# EAGLE design CarrierBoard_V7 (EAGLE 7.7.0)

## Sheet 1 of 2
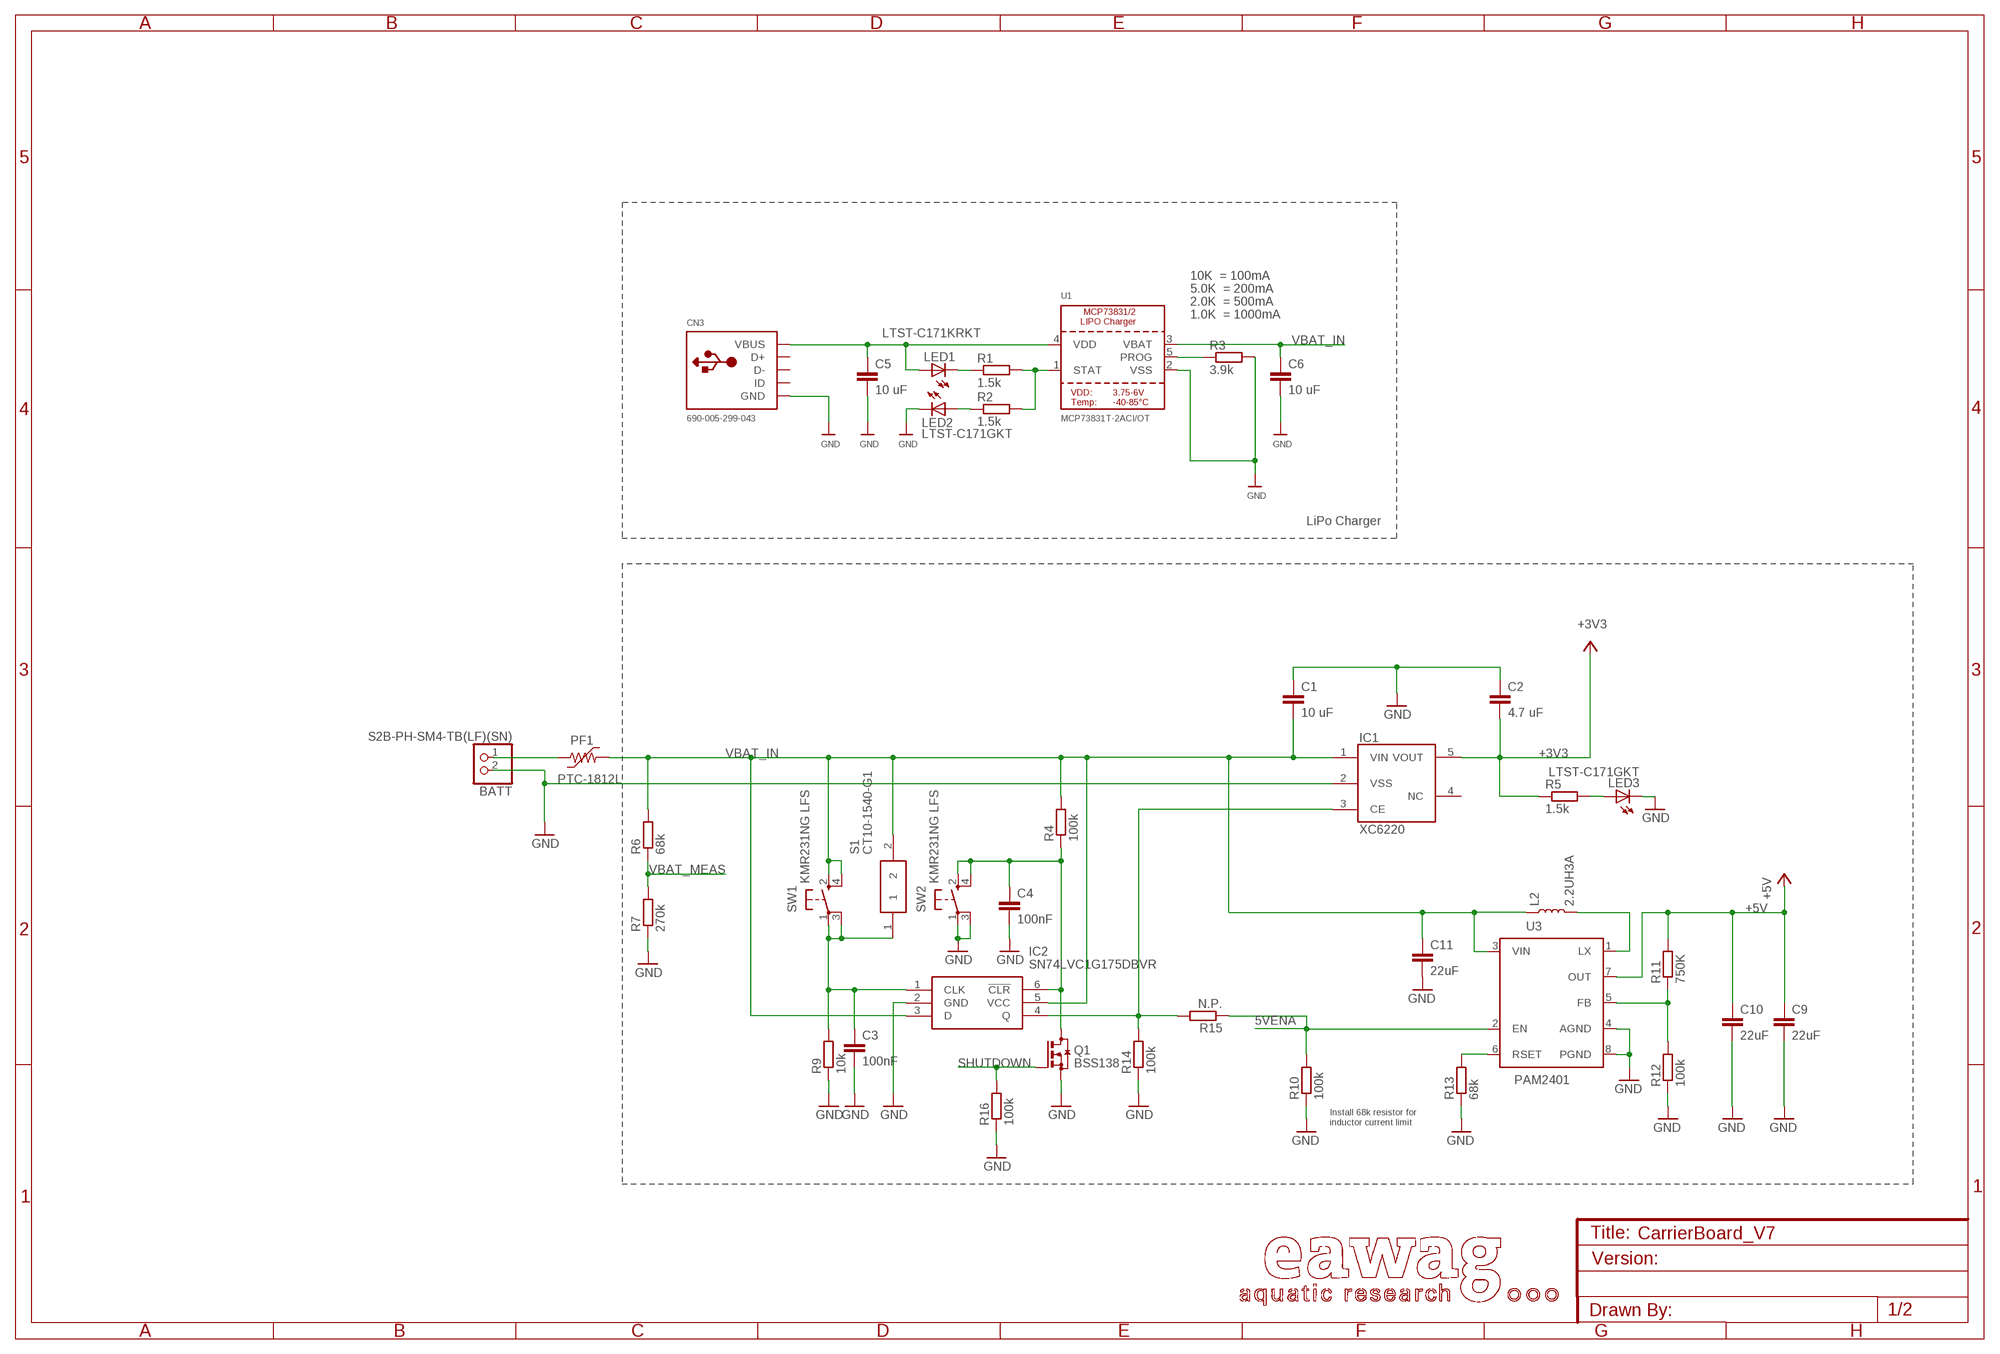
[diagram p0: schematic, sheet 1]

### Parts
BATT  S2B-PH-SM4-TB(LF)(SN)  JST_2PIN-SMT-RA  [JST-PH-2-SMT-RA]
C1  10 uF  C-EUC1206  [C1206]
C2  4.7 uF  C-EUC1206  [C1206]
C3  100nF  C-EUC0603  [C0603]
C4  100nF  C-EUC0603  [C0603]
C5  10 uF  C-EUC1206  [C1206]
C6  10 uF  C-EUC1206  [C1206]
C9  22uF  C-EUC0805  [C0805]
C10  22uF  C-EUC0805  [C0805]
C11  22uF  C-EUC0805  [C0805]
CN3  690-005-299-043  USBMINIB  [USB-MINIB]
IC1  XC6220SOT-25  [SOT25]
IC2  SN74LVC1G175DBVR  [SOT95P280X145-6N]
L2  2.2UH3A  INDUCTOR-IFSC1515AHER2R2M01  [INDUCTOR_4X4MM]
LED1  LTST-C171KRKT  LEDCHIPLED_0805  [CHIPLED_0805]
LED2  LTST-C171GKT  LEDCHIPLED_0805  [CHIPLED_0805]
LED3  LTST-C171GKT  LEDCHIPLED_0805  [CHIPLED_0805]
PF1  PTC-1812L  [1812L]
Q1  BSS138  [SOT23]
R1  1.5k  R-EU_R0603  [R0603]
R2  1.5k  R-EU_R0603  [R0603]
R3  3.9k  R-EU_R0603  [R0603]
R4  100k  R-EU_R0603  [R0603]
R5  1.5k  R-EU_R0603  [R0603]
R6  68k  R-EU_R0603  [R0603]
R7  270k  R-EU_R0603  [R0603]
R9  10k  R-EU_R0603  [R0603]
R10  100k  R-EU_R0603  [R0603]
R11  750K  R-EU_R0603  [R0603]
R12  100k  R-EU_R0603  [R0603]
R13  68k  R-EU_R0603  [R0603]
R14  100k  R-EU_R0603  [R0603]
R15  N.P.  R-EU_R0603  [R0603]
R16  100k  R-EU_R0603  [R0603]
S1  CT10-1540-G1  [CT101540G1]
SW1  KMR231NG LFS  SPST_TACT-KMR2  [KMR2]
SW2  KMR231NG LFS  SPST_TACT-KMR2  [KMR2]
U1  MCP73831T-2ACI/OT  MCP73831/2  [SOT23-5]
U3  PAM2401  [MSOP8]

### Nets
5VENA: R10.2 R15.1 U3.2(EN) ; also sheet 2
+3V3: C2.2 IC1.5(VOUT) R5.1 ; also sheet 2
+5V: C9.1 C10.1 R11.2 U3.7(OUT) ; also sheet 2
CLR: C4.1 IC2.6(!CLR) Q1.3(D) R4.1 SW2.2(S) SW2.4(S1)
GND: BATT.2 C1.1 C2.1 C3.2 C4.2 C5.2 C6.2 C9.2 C10.2 C11.2 CN3.GND IC1.2(VSS) IC2.2(GND) LED2.C LED3.C Q1.2(S) R3.2 R7.1 R9.1 R10.1 R12.1 R13.1 R14.1 R16.1 SW2.1(P) SW2.3(P1) U1.2(VSS) U3.4(AGND) U3.8(PGND) ; also sheet 2
N$1: LED1.C R1.1
N$2: R11.1 R12.2 U3.5(FB)
N$3: R1.2 R2.2 U1.1(STAT)
N$4: R3.1 U1.5(PROG)
N$9: LED3.A R5.2
N$10: BATT.1 PF1.1
N$18: L2.P$2 U3.1(LX)
N$19: R13.2 U3.6(RSET)
N$20: LED2.A R2.1
ON: C3.1 IC2.1(CLK) R9.2 S1.1 SW1.1(P) SW1.3(P1)
PWR_ENABLE: IC1.3(CE) IC2.4(Q) R14.2 R15.2
SHUTDOWN: Q1.1(G) R16.2 ; also sheet 2
VBAT_IN: C1.2 C6.1 C11.1 IC1.1(VIN) IC2.3(D) IC2.5(VCC) L2.P$1 PF1.2 R4.2 R6.2 S1.2 SW1.2(S) SW1.4(S1) U1.3(VBAT) U3.3(VIN)
VBAT_MEAS: R6.1 R7.2 ; also sheet 2
VDD1: C5.1 CN3.VBUS LED1.A U1.4(VDD)
Unconnected: CN3.D+ CN3.D- CN3.ID IC1.4(NC)

### Notes on the sheet
- 10K  = 100mA
- 5.0K  = 200mA
- 2.0K  = 500mA
- 1.0K  = 1000mA
- LiPo Charger
- Install 68k resistor for
  inductor current limit

## Sheet 2 of 2
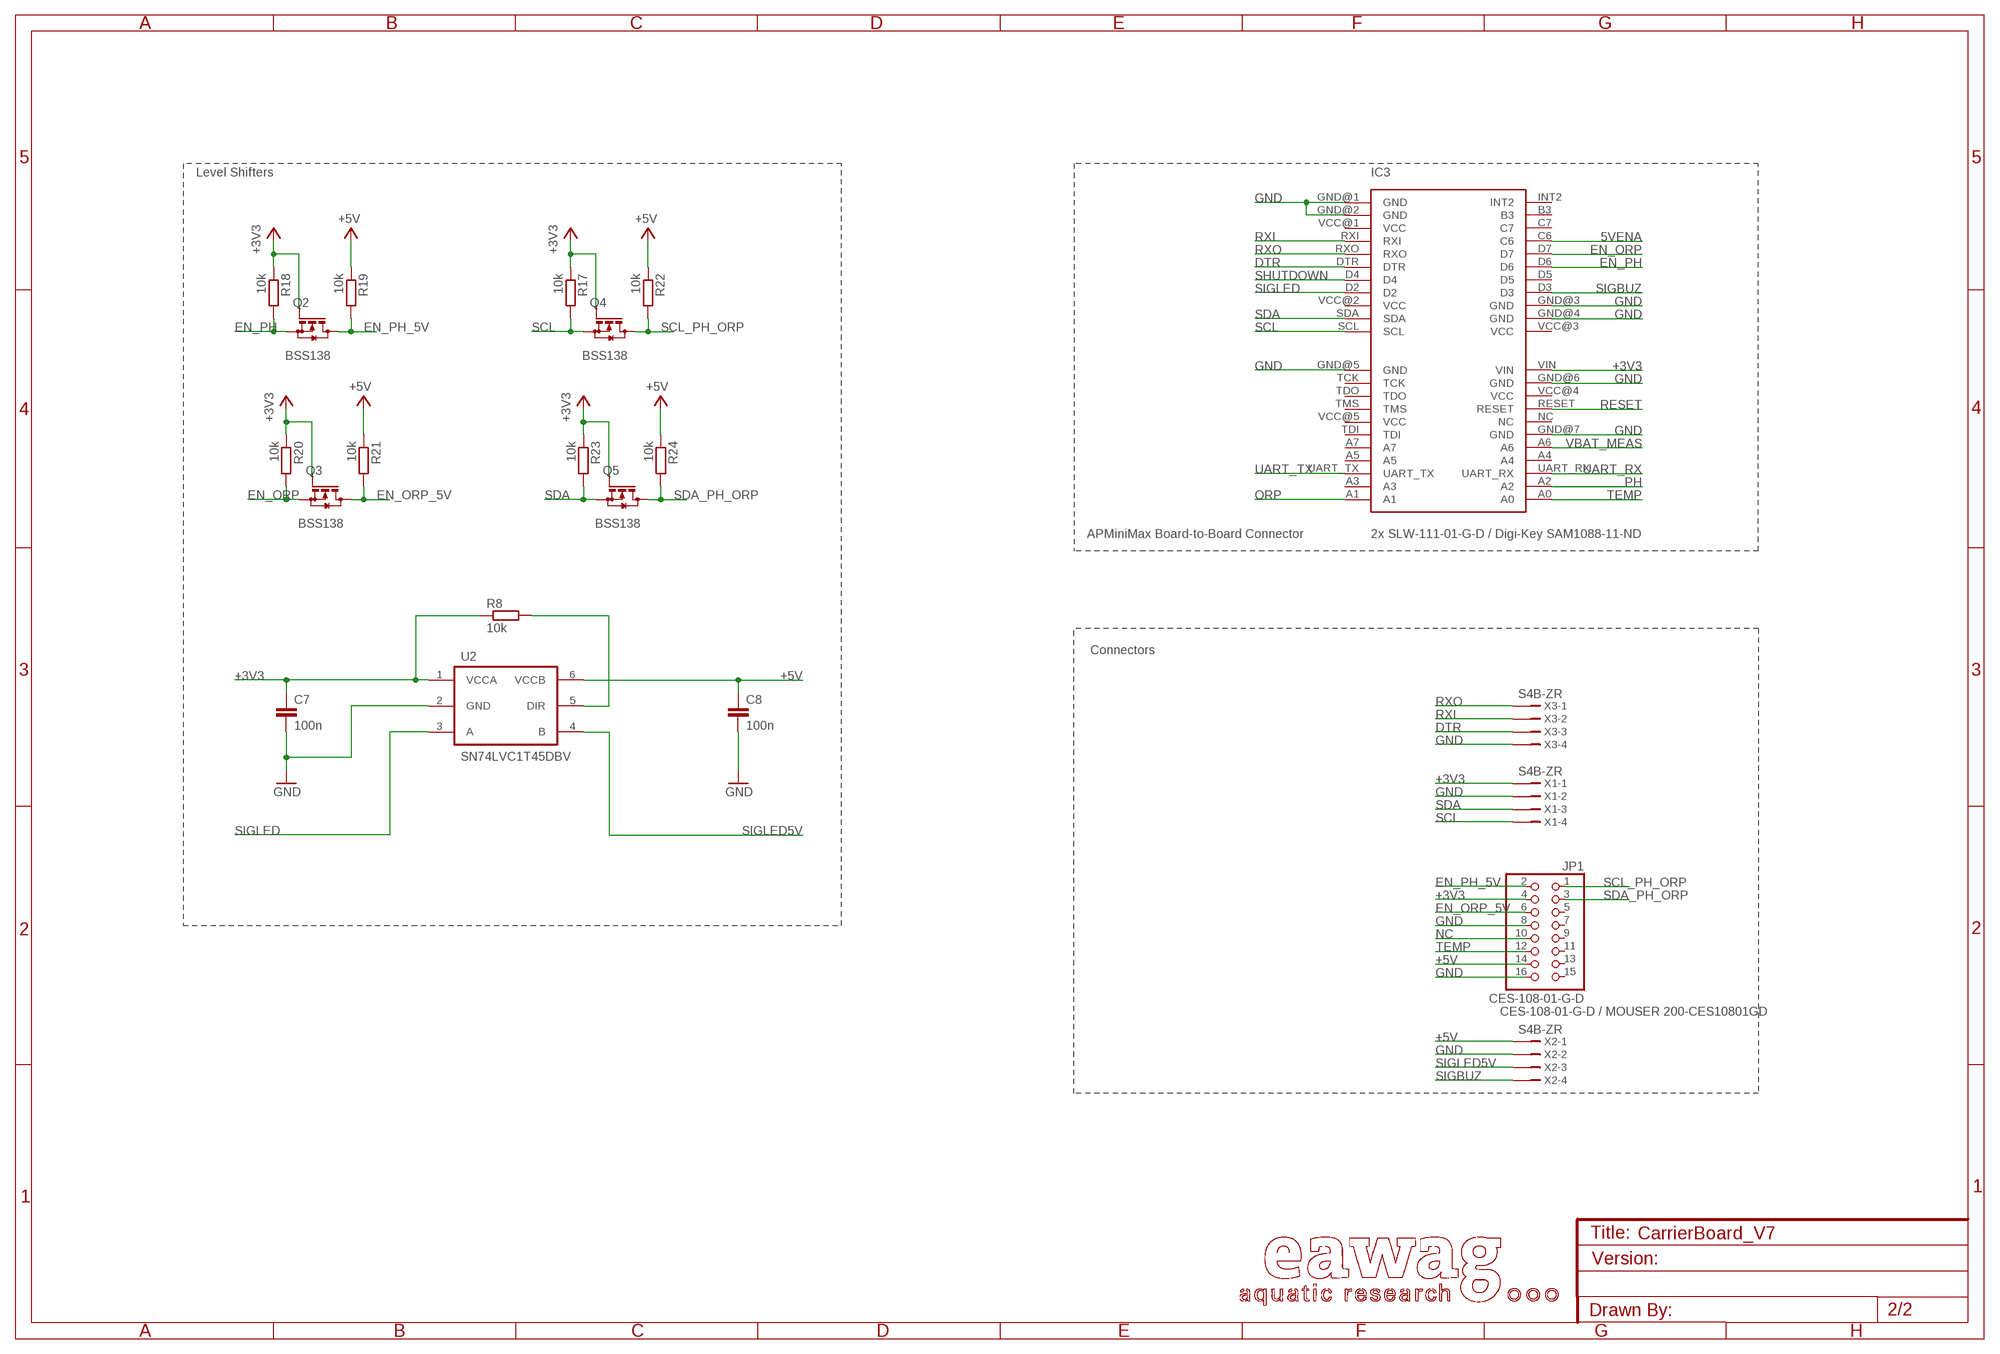
[diagram p1: schematic, sheet 2]

### Parts
C7  100n  C-EUC0805  [C0805]
C8  100n  C-EUC0805  [C0805]
IC3  SLW-111-01-G-D  APE  [APE]
JP1  CES-108-01-G-D  PINHD-2X8  [2X08]
Q2  BSS138  [SOT23]
Q3  BSS138  [SOT23]
Q4  BSS138  [SOT23]
Q5  BSS138  [SOT23]
R8  10k  R-EU_R0603  [R0603]
R17  10k  R-EU_R0603  [R0603]
R18  10k  R-EU_R0603  [R0603]
R19  10k  R-EU_R0603  [R0603]
R20  10k  R-EU_R0603  [R0603]
R21  10k  R-EU_R0603  [R0603]
R22  10k  R-EU_R0603  [R0603]
R23  10k  R-EU_R0603  [R0603]
R24  10k  R-EU_R0603  [R0603]
U2  SN74LVC1T45DBV  [SOT23-6]
X1  S4B-ZR  [S4B-ZR]
X2  S4B-ZR  [S4B-ZR]
X3  S4B-ZR  [S4B-ZR]

### Nets
5VENA: IC3.C6 ; also sheet 1
+3V3: C7.1 IC3.VIN JP1.4 Q2.1(G) Q3.1(G) Q4.1(G) Q5.1(G) R8.1 R17.1 R18.1 R20.1 R23.1 U2.1(VCCA) X1.1 ; also sheet 1
+5V: C8.1 JP1.14 R19.1 R21.1 R22.1 R24.1 U2.6(VCCB) X2.1 ; also sheet 1
DTR: IC3.DTR X3.3
EN_ORP: IC3.D7 Q3.2(S) R20.2
EN_ORP_5V: JP1.6 Q3.3(D) R21.2
EN_PH: IC3.D6 Q2.2(S) R18.2
EN_PH_5V: JP1.2 Q2.3(D) R19.2
GND: C7.2 C8.2 IC3.GND@1(GND) IC3.GND@2(GND) IC3.GND@3(GND) IC3.GND@4(GND) IC3.GND@5(GND) IC3.GND@6(GND) IC3.GND@7(GND) JP1.8 JP1.16 U2.2(GND) X1.2 X2.2 X3.4 ; also sheet 1
N$15: R8.2 U2.5(DIR)
NC: JP1.10
ORP: IC3.A1
PH: IC3.A2
RESET: IC3.RESET
RXI: IC3.RXI X3.2
RXO: IC3.RXO X3.1
SCL: IC3.SCL Q4.2(S) R17.2 X1.4
SCL_PH_ORP: JP1.1 Q4.3(D) R22.2
SDA: IC3.SDA Q5.2(S) R23.2 X1.3
SDA_PH_ORP: JP1.3 Q5.3(D) R24.2
SHUTDOWN: IC3.D4 ; also sheet 1
SIGBUZ: IC3.D3 X2.4
SIGLED: IC3.D2 U2.3(A)
SIGLED5V: U2.4(B) X2.3
TEMP: IC3.A0 JP1.12
UART_RX: IC3.UART_RX
UART_TX: IC3.UART_TX
VBAT_MEAS: IC3.A6 ; also sheet 1
Unconnected: IC3.A3 IC3.A4 IC3.A5 IC3.A7 IC3.B3 IC3.C7 IC3.D5 IC3.INT2 IC3.NC IC3.TCK IC3.TDI IC3.TDO IC3.TMS IC3.VCC@1(VCC) IC3.VCC@2(VCC) IC3.VCC@3(VCC) IC3.VCC@4(VCC) IC3.VCC@5(VCC) JP1.5 JP1.7 JP1.9 JP1.11 JP1.13 JP1.15

### Notes on the sheet
- Level Shifters
- APMiniMax Board-to-Board Connector | 2x SLW-111-01-G-D / Digi-Key SAM1088-11-ND
- Connectors
- CES-108-01-G-D / MOUSER 200-CES10801GD

## Library data of the parts
BATT = adafruit:JST_2PIN: JST 2-Pin Connectors of various flavors SMT-RA (S2B-PH-SM4) 4UConnector #17311 SMT (B2B-PH-SM4) THM-RA (S2B-PH) THM (B2B-PH)
C1 C2 C5-C8 = rcl:C-EU: CAPACITOR, European symbol
C3 C4 C9-C11 = 1_RCL-eawag:C-EU: CAPACITOR, European symbol
CN3 = adafruit:USB: USB Connectors USBMINIB - Surface Mount Female Mini-B USB Connector 4UConnector: 06564 By microbuilder.eu Thru-hole RA Female Mini-B USB Connector 4UConnector: 18732 By ladyada.net
IC1 = eawag:XC6220: XC6220 Series 1A LDO Voltage Regulator with "Green Operation" Digikey Part Nr: 893-1133-1-ND
IC2 = SamacSys_Parts:SN74LVC1G175DBVR: Single D-Type Flip-Flop with Asynchronous Clear Source: Datasheet <http://www.ti.com/lit/ds/symlink/sn74lvc1g175.pdf>; DESCRIPTION: Single D-Type Flip-Flop with Asynchronous Clear; HEIGHT: 1.45mm; MANUFACTURER_NAME: Texas Instruments; MANUFACTURER_PART_NUMBER: SN74LVC1G175DBVR; MOUSER_PART_NUMBER: 595-SN74LVC1G175DBVR; MOUSER_PRICE-STOCK: https://www.mouser.com/Search/Refine.aspx?Keyword=595-SN74LVC1G175DBVR
IC3 = eawag:APE
JP1 = pinhead:PINHD-2X8: PIN HEADER
L2 = SparkFun-Coils:INDUCTOR: Inductors Resist changes in electrical current. Basically a coil of wire. SparkFun Products: SparkFun Load Cell Amplifier - HX711 <https://www.sparkfun.com/products/13879> IOIO-OTG - V2.2 <https://www.sparkfun.com/products/13613>; PROD_ID: NDUC-13770
LED1 LED2 = adafruit:LED: LED OSRAM: - CHIPLED LG R971, LG N971, LY N971, LG Q971, LY Q971, LO R971, LY R971 LH N974, LH R974 LS Q976, LO Q976, LY Q976 LO Q996 - Hyper CHIPLED LW Q18S LB Q993, LB Q99A, LB R99A - SideLED LS A670, LO A670, LY A670, LG A670, LP A670 LB A673, LV A673, LT A673, LW A673 LH A674 LY A675 LS A676, LA A676, LO A676, LY A676, LW A676 LS A679, LY A679, LG A679 - Hyper Micro SIDELED® LS Y876, LA Y876, LO Y876, LY Y876 LT Y87S - SmartLED LW L88C, LW L88S LB L89C, LB L89S, LG L890 LS L89K, LO L89K, LY L89K LS L896, LA L896, LO L896, LY L896 - TOPLED LS T670, LO T670, LY T670, LG T670, LP T670 LSG T670, LSP T670, LSY T670, LOP T670, LYG T670 LG T671, LOG T671, LSG T671 LB T673, LV T673, LT T673, LW T673 LH T674 LS T676, LA T676, LO T676, LY T676, LB T676, LH T676, LSB T676, LW T676 LB T67C, LV T67C, LT T67C, LS T67K, LO T67K, LY T67K, LW E67C LS E67B, LA E67B, LO E67B, LY E67B, LB E67C, LV E67C, LT E67C LW T67C LS T679, LY T679, LG T679 LS T770, LO T770, LY T770, LG T770, LP T770 LB T773, LV T773, LT T773, LW T773 LH T774 LS E675, LA E675, LY E675, LS T675 LS T776, LA T776, LO T776, LY T776, LB T776 LHGB T686 LT T68C, LB T68C - Hyper Mini TOPLED® LB M676 - Mini TOPLED Santana® LG M470 LS M47K, LO M47K, LY M47K Source: http://www.osram.convergy.de/
LED3 = eawag:LED: LED OSRAM: - CHIPLED LG R971, LG N971, LY N971, LG Q971, LY Q971, LO R971, LY R971 LH N974, LH R974 LS Q976, LO Q976, LY Q976 LO Q996 - Hyper CHIPLED LW Q18S LB Q993, LB Q99A, LB R99A - SideLED LS A670, LO A670, LY A670, LG A670, LP A670 LB A673, LV A673, LT A673, LW A673 LH A674 LY A675 LS A676, LA A676, LO A676, LY A676, LW A676 LS A679, LY A679, LG A679 - Hyper Micro SIDELED® LS Y876, LA Y876, LO Y876, LY Y876 LT Y87S - SmartLED LW L88C, LW L88S LB L89C, LB L89S, LG L890 LS L89K, LO L89K, LY L89K LS L896, LA L896, LO L896, LY L896 - TOPLED LS T670, LO T670, LY T670, LG T670, LP T670 LSG T670, LSP T670, LSY T670, LOP T670, LYG T670 LG T671, LOG T671, LSG T671 LB T673, LV T673, LT T673, LW T673 LH T674 LS T676, LA T676, LO T676, LY T676, LB T676, LH T676, LSB T676, LW T676 LB T67C, LV T67C, LT T67C, LS T67K, LO T67K, LY T67K, LW E67C LS E67B, LA E67B, LO E67B, LY E67B, LB E67C, LV E67C, LT E67C LW T67C LS T679, LY T679, LG T679 LS T770, LO T770, LY T770, LG T770, LP T770 LB T773, LV T773, LT T773, LW T773 LH T774 LS E675, LA E675, LY E675, LS T675 LS T776, LA T776, LO T776, LY T776, LB T776 LHGB T686 LT T68C, LB T68C - Hyper Mini TOPLED® LB M676 - Mini TOPLED Santana® LG M470 LS M47K, LO M47K, LY M47K Source: http://www.osram.convergy.de/
PF1 = polyswitch:PTC-: POLYSWITCH Polyswitch Resetable Fuses
Q1-Q5 = transistor-small-signal:BSS138: N-CHANNEL MOS FET
R1-R4 R6 R9-R24 = 1_RCL-eawag:R-EU_: RESISTOR, European symbol
R5 R7 R8 = rcl:R-EU_: RESISTOR, European symbol
S1 = SamacSys_Parts:CT10-1540-G1: Magnetic / Reed Switches MOLDED 15-40AT SPST Source: Datasheet <https://componentsearchengine.com/Datasheets/1/CT10-1540-G1.pdf>; DESCRIPTION: Magnetic / Reed Switches MOLDED 15-40AT SPST; HEIGHT: 2.92mm; MANUFACTURER_NAME: Coto Technology; MANUFACTURER_PART_NUMBER: CT10-1540-G1; MOUSER_PART_NUMBER: 816-CT10-1540-G1; MOUSER_PRICE-STOCK: https://www.mouser.com/Search/Refine.aspx?Keyword=816-CT10-1540-G1
SW1 SW2 = adafruit:SPST_TACT: SMT 6mm switch, EVQQ2 series http://www.ladyada.net/library/eagle
U1 = microbuilder:MCP73831/2: MCP73831/2 LIPO Charger VDD: 3.75 - 6V Temp -40 - 85°C Programmable Charge Rate: 15-500mA NOTE: STAT is a tri-state logic output on the MCP73831 and an open-drain output on the MCP73832. SOT23-5 with 4.2V output and tri-state logic on STAT = MCP73831T-2ACI/OT
U2 = 74LV:SN74LVC1T45: SINGLE-BIT DUAL-SUPPLY BUS TRANSCEIVER
U3 = SparkFun-IC-Power:PAM2401: PAM2401 - Boost PMIC Specifications: Up to 1A output current 0.9V to 4.75V Input Range 2.5V to 5.0V Adjustable Output Voltage Datasheet <https://www.diodes.com/assets/Datasheets/PAM2401.pdf> (Diodes inc.); PROD_ID: IC-13769
X1-X3 = con-jst:?4B-ZR: ZH CONNECTOR 1.5 mm, 4 pin 1 row Source: http://www.jst.com .. eZH.pdf; MF: FARNELL; MPN: S4B-ZR(LF)(SN); OC_FARNELL: 9491830; OC_NEWARK: 38K8076

## Board
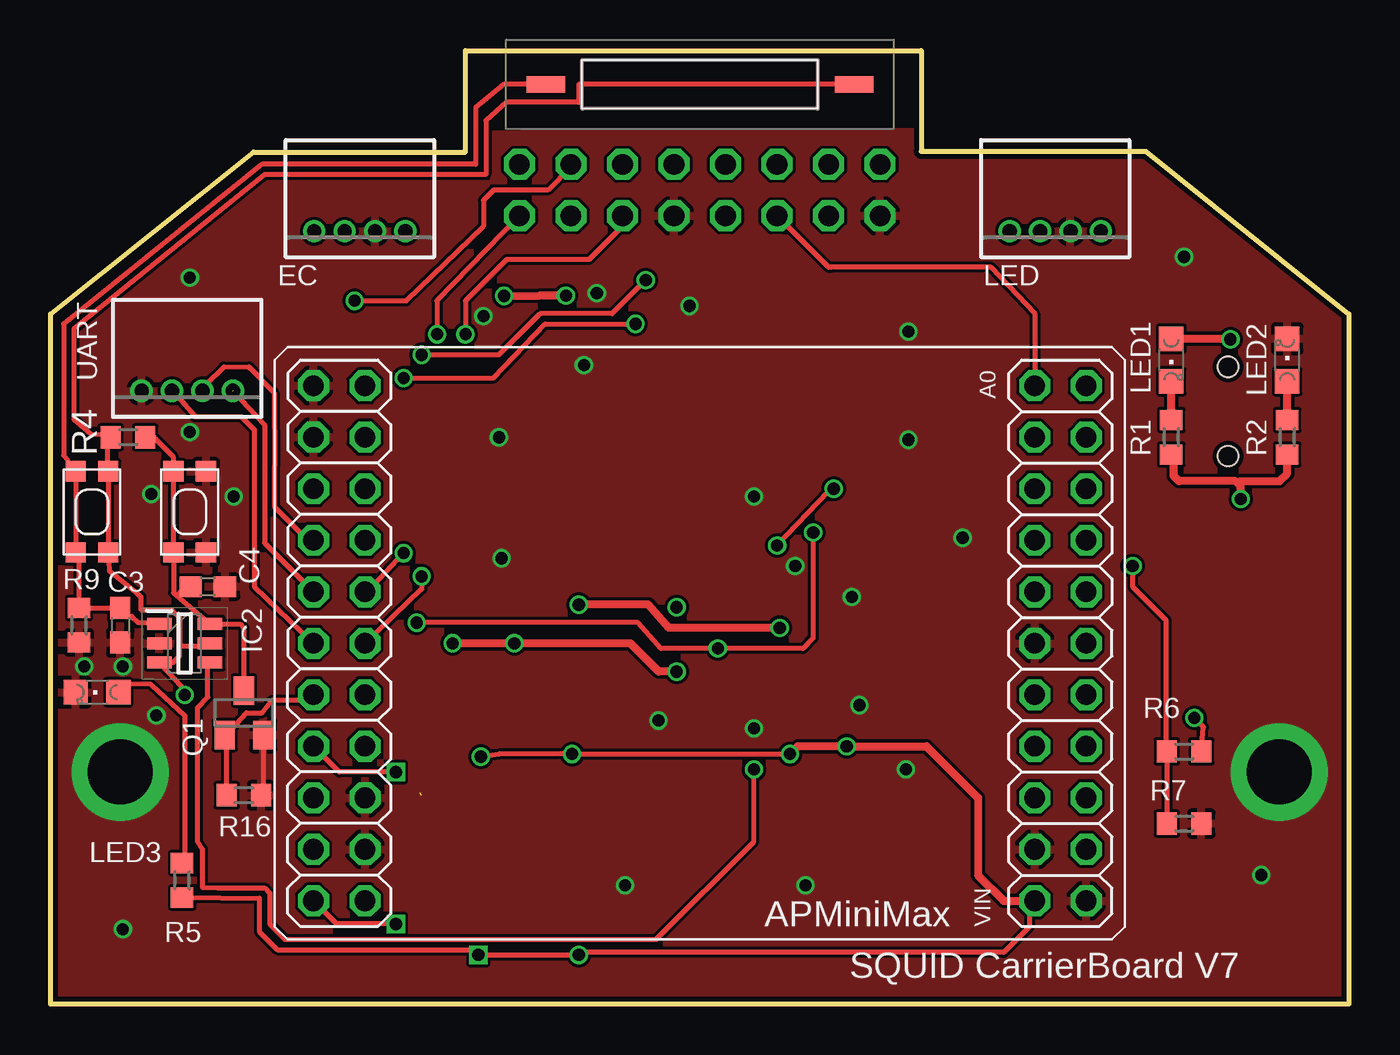
[diagram p2: board, top side]
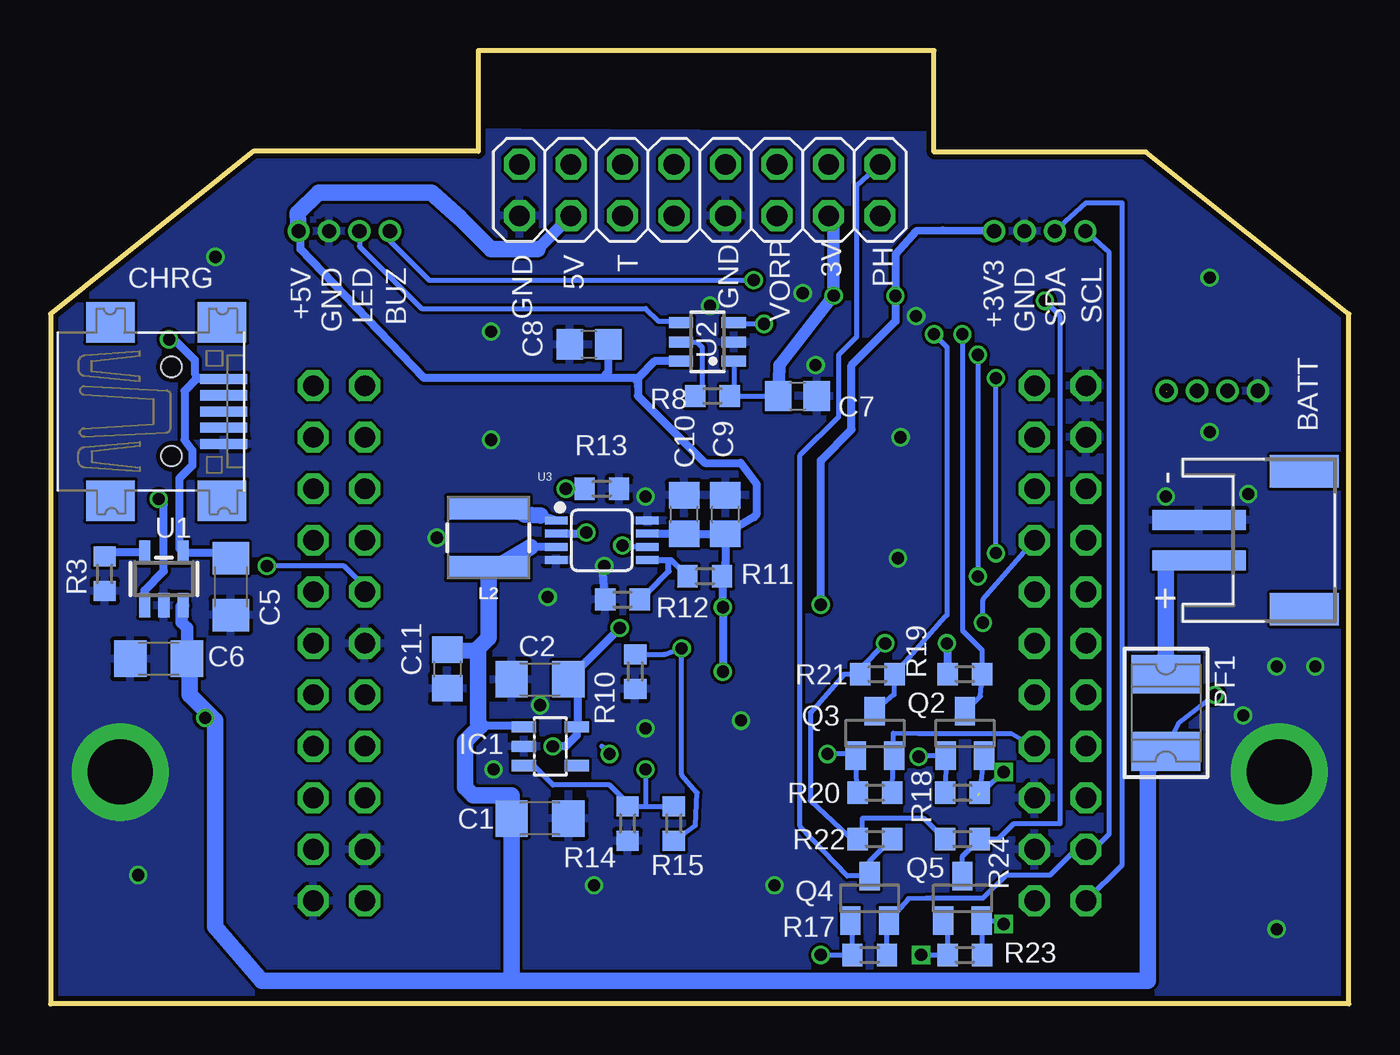
[diagram p3: board, bottom side, seen from below]

Size 64 x 47 mm. Coordinates in mm from the lower left corner, seen from the top.
Outline: 64,34.02 64,0 0,0 0,34.02 10,42 20.45,42 20.45,47 42.93,47 42.93,42.04 54,42.04 64,34.02
Copper layers (1*16): Top 0.018mm / dielectric 1.55mm / Bottom 0.018mm
Design rules "eC_2Layer_PClass6_BaseCopperO18_eCDefault": minimum track width 0.15mm, minimum drill 0.35mm, track to track 0.15mm, track to pad 0.15mm, pad to pad 0.15mm, via to via 0.15mm, smd to smd 0mil, copper to edge 0.25mm, drill to drill 0.35mm, minimum pad ring 0.175mm, minimum via ring 0.125mm, stop-mask expansion 0mil, vias tented up to drill 0.45mm, thermal gap 0.2mm

### Footprints (pad centres in the part's own frame; a part is rotated, then mirrored left to right if it is on the bottom)
JST-PH-2-SMT-RA = smd 1 x 4.6: 1 1,-3.7; 2 -1,-3.7 | smd 1.6 x 3.4: NC1 -3.4,1.5; NC2 3.4,1.5
C1206 = smd 1.6 x 1.8: 1 -1.4,0; 2 1.4,0
C0603 = smd 1.1 x 1: 1 -0.85,0; 2 0.85,0
C0805 = smd 1.3 x 1.5: 1 -0.95,0; 2 0.95,0
USB-MINIB = smd 0.5 x 2.308: D+ 0,3.588; D- -0.8,3.588; GND 1.6,3.588; ID 0.8,3.588; VBUS -1.6,3.588 | smd 2 x 2.4: GND1 -4.4,-2; GND2 -4.4,3.5; GND3 4.4,3.5; GND4 4.4,-2 | hole 1: -2.2,1; 2.2,1
SOT25 = smd 0.55 x 1.2: 1 -0.95,-1.3; 2 0,-1.3; 3 0.95,-1.3; 4 0.95,1.3; 5 -0.95,1.3
SOT95P280X145-6N = smd 1.2 x 0.6: 1 -1.25,0.95; 2 -1.25,0; 3 -1.25,-0.95; 4 1.25,-0.95; 5 1.25,0; 6 1.25,0.95
APE = drill 1.016 octagon: A0 16.51,12.7; A1 19.05,12.7; A2 16.51,10.16; A3 19.05,10.16; A4 16.51,5.08; A5 19.05,5.08; A6 16.51,2.54; A7 19.05,2.54; B3 -16.51,10.16; C6 -16.51,5.08; C7 -16.51,7.62; D2 -16.51,2.54; D3 -16.51,0; D4 -19.05,-2.54; D5 -16.51,-2.54; D6 -19.05,-5.08; D7 -16.51,-5.08; DTR -19.05,0; GND@1 -19.05,12.7; GND@2 -19.05,10.16; GND@3 -16.51,-7.62; GND@4 -16.51,-10.16; GND@5 19.05,-12.7; GND@6 16.51,-10.16; GND@7 16.51,0; INT2 -16.51,12.7; NC 16.51,-2.54; RESET 16.51,-5.08; RXI -19.05,5.08; RXO -19.05,2.54; SCL -19.05,-10.16; SDA -19.05,-12.7; TCK 19.05,-10.16; TDI 19.05,0; TDO 19.05,-7.62; TMS 19.05,-5.08; UART_RX 16.51,7.62; UART_TX 19.05,7.62; VCC@1 -19.05,7.62; VCC@2 -19.05,-7.62; VCC@3 -16.51,-12.7; VCC@4 16.51,-7.62; VCC@5 19.05,-2.54; VIN 16.51,-12.7
2X08 = drill 1.016 octagon: 1 -8.89,-1.27; 2 -8.89,1.27; 3 -6.35,-1.27; 4 -6.35,1.27; 5 -3.81,-1.27; 6 -3.81,1.27; 7 -1.27,-1.27; 8 -1.27,1.27; 9 1.27,-1.27; 10 1.27,1.27; 11 3.81,-1.27; 12 3.81,1.27; 13 6.35,-1.27; 14 6.35,1.27; 15 8.89,-1.27; 16 8.89,1.27
INDUCTOR_4X4MM = smd 4.089 x 1.143: P$1 0,1.473; P$2 0,-1.473
CHIPLED_0805 = smd 1.2 x 1.2: A 0,-1.05; C 0,1.05
1812L = smd 1.905 x 3.404: 1 -1.905,0; 2 1.905,0
SOT23 = smd 1 x 1.4: 1 -0.95,-1.1; 2 0.95,-1.1; 3 0,1.1
R0603 = smd 1 x 1.1: 1 -0.85,0; 2 0.85,0
CT101540G1 = smd 1.9 x 0.8: 1 -7.6,0; 2 7.6,0
KMR2 = smd 1 x 1: 1 2,0.8; 2 2,-0.8; 3 -2,0.8; 4 -2,-0.8
SOT23-5 = smd 0.55 x 1.2: 1 -0.95,-1.3; 2 0,-1.3; 3 0.95,-1.3; 4 0.95,1.3; 5 -0.95,1.3
SOT23-6 = smd 0.55 x 1.2: 1 -0.95,-1.3; 2 0,-1.3; 3 0.95,-1.3; 4 0.95,1.3; 5 0,1.3; 6 -0.95,1.3
MSOP8 = smd 0.4 x 1.1: 1 -0.975,-2.25; 2 -0.325,-2.25; 3 0.325,-2.25; 4 0.975,-2.25; 5 0.975,2.25; 6 0.325,2.25; 7 -0.325,2.25; 8 -0.975,2.25
S4B-ZR = drill 0.7 pad 1.1: 1 -2.25,0; 2 -0.75,0; 3 0.75,0; 4 2.25,0

### Placement (x,y rotation side)
BATT  3.68,22.86 270 bottom
C1  39.88,9.14 180 bottom
C2  39.88,16 0 bottom
C3  3.43,18.67 270 top
C4  7.75,20.57 0 top
C5  55.12,20.57 270 bottom
C6  58.67,17.02 180 bottom
C7  27.18,29.97 0 bottom
C8  37.47,32.51 180 bottom
C9  30.73,24.13 90 bottom
C10  32.77,24.13 90 bottom
C11  44.45,16.51 270 bottom
CN3  59.05,29.21 270 bottom
IC1  39.37,12.7 270 bottom
IC2  6.6,17.78 0 top
IC3  32,17.78 0 top
JP1  32,40.13 180 bottom
L2  42.42,22.99 180 bottom
LED1  55.24,31.75 180 top
LED2  60.96,31.75 0 top
LED3  2.29,15.37 90 top
PF1  9.02,14.35 270 bottom
Q1  9.53,14.35 0 top
Q2  18.92,13.34 0 bottom
Q3  23.37,13.34 0 bottom
Q4  23.62,5.21 0 bottom
Q5  19.05,5.21 0 bottom
R1  55.24,27.94 270 top
R2  60.96,27.94 270 top
R3  61.34,21.21 270 bottom
R4  3.81,27.94 180 top
R5  6.48,6.1 90 top
R6  55.88,12.45 0 top
R7  55.88,8.89 180 top
R8  31.37,29.97 180 bottom
R9  1.4,18.67 90 top
R10  35.18,16.38 90 bottom
R11  31.75,21.08 0 bottom
R12  35.81,19.94 0 bottom
R13  36.83,25.4 180 bottom
R14  35.56,8.89 90 bottom
R15  33.27,8.89 90 bottom
R16  9.53,10.29 180 top
R17  23.62,2.41 0 bottom
R18  19.05,10.41 0 bottom
R19  18.92,16.26 0 bottom
R20  23.37,10.41 0 bottom
R21  23.24,16.26 0 bottom
R22  23.37,8.13 0 bottom
R23  18.92,2.41 0 bottom
R24  19.05,8.13 0 bottom
S1  32,45.34 0 top
SW1  2.03,24.26 90 top
SW2  6.86,24.26 270 top
U1  58.42,20.95 0 bottom
U2  31.62,32.64 90 bottom
U3  36.83,22.86 270 bottom
X1  15.24,38.1 180 top
X2  49.53,38.1 180 top
X3  6.73,30.23 180 top

### Tracks (layer width: path | path; a pad name or v marks a point on that pad's centre or on a via)
5VENA  (via drill 0.6)
  Top 0.254: v37.59,23.24 37.59,18.03 37.08,17.53 v32.89,17.53 30.1,17.53 28.96,18.8 v18.03,18.8
  Bottom 0.254: v18.03,18.8 18.03,19.94 IC3.C6 | R10.2 33.74,17.23 v32.89,17.53 32.89,11.3 32.13,10.41 32.22,8.8 R15.1
  Bottom 0.406: U3.2 37.59,23.18 v37.59,23.24
+3V3  (via drill 0.6)
  Top 0.254: v36.45,12.32 v25.71,12.32 22.1,12.32 v21.21,12.19 | R5.1 10.29,5.21 10.29,3.56 11.18,2.67 20.83,2.67 v21.08,2.41 v26.04,2.41 | 48.26,5.08 48.26,3.81 46.99,2.54 26.16,2.54
  Top 0.406: IC3.VIN 48.26,5.08 46.99,5.08 45.72,6.35 45.72,10.16 43.18,12.7 v39.24,12.7 36.83,12.7 v36.45,12.32 | 26.16,2.54 v26.04,2.41 | v35.94,18.54 30.48,18.54 29.46,19.68 v26.04,19.68 | v25.4,34.92 24.13,34.92 v22.35,34.91
  Bottom 0.254: U2.1 30.32,30.07 R8.1 C7.1 | v25.71,12.32 24.38,12.32 24.02,12.08 Q3.1 R20.1 | v36.45,12.32 36.83,12.7 | R18.1 Q2.1 21.17,12.23 v21.21,12.19 | 38.1,15.24 38,15.24 | Q4.1 24.47,4.01 R17.1 v26.04,2.41 | Q5.1 19.77,3.88 R23.1 v21.08,2.41
  Bottom 0.406: v39.24,12.7 38.61,12.7 38.07,13.24 IC1.5 38,13.72 38,15.24 38,15.53 C2.2 37.59,16.89 v35.94,18.54 | v26.04,19.68 26.04,26.8 24.51,28.32 24.51,31.5 22.35,33.66 v22.35,34.91 22.35,36.96 21.34,38.1 20.03,38.14 X1.1 | 25.4,38.75 25.53,38.75
  Bottom 0.61: 25.4,38.75 v25.4,34.92 28.07,31.5 C7.1 | 25.53,38.75 JP1.4
+5V  (via drill 0.6)
  Top 0.406: v30.86,16.38 29.97,16.38 28.57,17.78 v22.86,17.78 v19.81,17.78
  Bottom 0.254: 35.31,30.86 35.05,30.48 | R24.1 19.94,8.13 20.95,9.14 24,9.14 24,8.34 R22.1 24.34,8 26.54,10.03 26.54,14.35 24.89,16.26 R21.1 | R21.1 24.09,16.47 | v22.86,17.78 24.09,16.51 R21.1
  Bottom 0.406: X2.1 51.69,38.01 51.69,37.21 45.59,30.86 36.83,30.86 | U2.6 34.22,31.69 35.05,30.86 | 35.05,30.86 35.18,30.86 | 35.31,30.86 36.83,30.86 | C8.1 36.52,31.18 36.83,30.86 | U3.7 32.81,23.18 C10.1 C9.1 | C9.1 30.73,21.76 R11.2 v30.86,19.56 v30.86,16.38 | 35.05,30.86 35.05,30.48 35.05,29.97 31.75,26.67 29.97,26.67 29.21,25.65 29.21,24.13 29.33,24 C9.1 | v19.81,17.78 R19.1
  Bottom 0.61: 40,37.21 JP1.14
  Bottom 0.813: X2.1 51.82,38.99 50.8,40.01 45.21,40.01 43.81,38.73 42.29,37.21 40,37.21
CLR
  Top 0.254: R4.1 5.08,27.94 6.06,26.96 SW2.4 SW2.2 6.06,20.27 6.2,20.15 | 6.2,20.15 IC2.6 | IC2.6 9.3,18.73 | C4.1 6.63,20.57 6.2,20.15 | IC2.6 9.34,18.73 9.53,18.54 Q1.3
DTR
  Top 0.254: X3.3 6.24,29.96 7.11,28.96 9.4,28.96 10.03,28.32 10.03,20.57 IC3.DTR
EN_ORP
  Bottom 0.254: R20.2 Q3.2 22.46,13.35 21.21,13.34 16.64,13.34 IC3.D7
EN_ORP_5V  (via drill 0.6)
  Top 0.254: v20.45,33.02 20.45,34.67 22.48,36.7 26.54,36.7 28.19,38.35 JP1.6
  Bottom 0.254: Q3.3 22.42,15.26 R21.2 19.88,19.11 19.81,19.18 19.81,32.38 v20.45,33.02
EN_PH  (via drill 0.6)  (1 unrouted)
  Top 0.254: v17.02,11.43 14.22,11.43 IC3.D6
  Bottom 0.254: 18.29,10.29 v17.02,11.43 | R18.2 Q2.2
EN_PH_5V  (via drill 0.6)
  Top 0.254: v19.05,33.02 19.05,34.67 JP1.2
  Bottom 0.254: v19.05,33.02 19.05,18.41 18.07,17.44 R19.2 18.16,15.18 Q2.3
GND  (via drill 0.6, 3.2)
  Top 0.254: Q1.2 10.47,10.39 R16.1
  Bottom 0.406: R12.1 36.79,21.55 v36.7,21.59
  other vias: 3.42,11.43 60.58,11.43 28.32,5.84 26.29,31.5 55.88,36.83 6.86,28.19 59.69,6.35 42.16,11.56 42.29,33.15 31.5,34.42 37.21,5.84 42.29,27.81 34.67,25.02 44.96,22.99 39.5,20.07 39.88,14.73 34.67,13.59 22.23,21.97 22.1,27.94 6.86,35.81 4.95,25.15 3.56,16.64 1.65,16.64 5.21,14.22 9.02,25.02 3.56,3.68 26.92,35.05 21.34,33.91 29.97,13.97
  pour Bottom: 64.9,-0.51 64.77,34.42 54.1,43.05 9.91,42.8 9.91,42.67 -0.25,34.8 -0.38,-0.25
  pour Top: 64.9,34.29 64.77,34.29 54.1,43.05 9.91,42.8 -0.13,34.8 -0.38,-0.25 64.9,-0.64
N$1
  Top 0.406: R1.1 LED1.C
N$2
  Bottom 0.305: U3.5 33.53,21.89 | 33.53,21.89 33.4,21.89 R11.1 | R12.2 34.54,20.32 33.53,21.34 33.53,21.89
N$3  (via drill 0.6)
  Top 0.406: v58.67,24.89 58.67,25.53 | 58.67,25.53 58.67,25.78 60.58,25.78 60.96,26.16 R2.2 60.89,26.92 | 58.67,25.53 58.42,25.78 55.63,25.78 55.37,26.04 55.37,26.86 R1.2
  Bottom 0.406: U1.1 59.37,20.39 58.42,21.34 58.42,24.64 v58.67,24.89
N$4
  Bottom 0.406: U1.5 61.24,22.25 R3.1
N$9
  Top 0.254: LED3.A 3.56,15.78 4.95,15.75 6.6,14.22 6.6,7.07 R5.2
N$10
  Bottom 0.813: PF1.1 9.02,21.86 BATT.1
N$15
  Bottom 0.254: U2.5 32.13,32.64 31.88,32.38 31.88,30.41 R8.2
N$18
  Bottom 0.406: U3.1 39.84,24.09 | 40.64,24.13 42.09,24.13 L2.P$2
  Bottom 0.813: 39.84,24.09 40.64,24.13
N$19  (via drill 0.6)
  Top 0.254: v35.81,22.61 38.35,25.27 38.73,25.27 v38.61,25.4
  Bottom 0.254: U3.6 35.74,22.54 v35.81,22.61 | v38.61,25.4 R13.2
N$20
  Top 0.406: R2.1 LED2.A
ON
  Top 0.254: S1.1 22.35,45.34 20.95,44.2 20.95,41.4 10.41,41.4 0.64,33.53 0.64,27.06 SW1.1 SW1.3 1.4,22.09 R9.2 C3.1 3.43,19.11 4,19.11 4.32,18.8 5.03,18.8 IC2.1
PWR_ENABLE  (via drill 0.6)
  Top 0.254: v34.67,11.56 34.67,8 29.84,3.17 11.56,3.17 10.79,3.94 10.79,5.46 10.54,5.71 8.26,5.71 7.47,5.74 7.47,7.64 7.24,8 7.24,14.61 7.75,15.11 7.75,16.72 IC2.4
  Bottom 0.254: IC1.3 40.6,11.68 40.13,11.68 39.24,10.79 36.45,10.79 35.56,9.91 R14.2 34.67,9.74 | 34.67,9.74 R15.2 | v34.67,11.56 34.67,9.74
RXI
  Top 0.254: IC3.RXI 12.7,22.86 11.05,24.51 11.05,26.54 11.01,30.14 9.78,31.41 9.78,31.37 8.54,31.41 7.62,30.48 7.62,30.36 X3.2
RXO  (1 unrouted)
  Top 0.254: IC3.RXO 10.54,22.73 10.54,28.57 9.01,30.23
SCL
  Bottom 0.254: X1.4 11.81,37.05 11.81,8.38 12.57,7.62 IC3.SCL 13.46,7.62 14.73,6.35 16.89,6.35 18.03,5.21 20.83,5.21 21.72,5.18 Q4.2 22.77,4.01 R17.2
SCL_PH_ORP
  Bottom 0.254: R22.2 23.62,7.02 Q4.3 24.72,6.31 27.05,8.76 27.05,27.05 25.15,28.96 25.15,32 24.26,32.89 24.26,40.38 JP1.1
SDA  (via drill 0.6)
  Top 0.254: v17.02,3.94 14.1,3.94 IC3.SDA
  Bottom 0.254: X1.3 12.95,39.48 11.18,39.48 11.18,6.86 IC3.SDA | v17.02,3.94 17.19,4.11 Q5.2 18.07,4.08 R23.2
SDA_PH_ORP  (via drill 0.6)
  Top 0.254: v14.99,34.67 17.53,34.67 21.34,38.35 21.34,39.62 21.84,40.13 24.51,40.13 25.65,41.27 JP1.3
  Bottom 0.254: Q5.3 19.05,7.28 R24.2 17.27,8.13 16.51,8.89 14.22,8.89 14.22,33.91 v14.99,34.67
SHUTDOWN
  Top 0.254: IC3.D4 12.7,14.99 10.92,14.99 10.41,14.35 9.65,14.35 8.68,13.25 Q1.1 8.68,13.15 R16.2
SIGBUZ  (via drill 0.6)
  Top 0.254: v29.34,35.69 27.69,34.04 24.13,34.04 22.1,32 v18.29,32 | IC3.D3 18.29,20.45 v18.29,21.08
  Bottom 0.254: X2.4 47.28,37.63 45.34,35.69 v29.34,35.69 | v18.29,32 v18.29,21.08
SIGLED  (via drill 0.6)
  Top 0.254: IC3.D2 15.62,20.32 v17.4,22.23 | v17.4,30.86 21.84,30.86 24.38,33.53 v28.83,33.53
  Bottom 0.254: v17.4,22.23 v17.4,30.86 | v28.83,33.53 30.26,33.53 U2.3
SIGLED5V
  Bottom 0.254: X2.3 48.78,37.35 45.72,34.29 34.67,34.29 34.04,33.66 32.99,33.66 U2.4
TEMP
  Top 0.254: IC3.A0 48.51,34.04 46.35,36.32 38.48,36.32 38.35,36.32 JP1.12
VBAT_IN  (via drill 0.6)
  Top 0.254: R6.2 56.83,13.65 v56.39,14.1 | S1.2 26.04,45.34 26.04,44.45 22.48,44.45 21.46,43.56 21.46,40.89 10.54,40.89 1.14,33.27 1.14,28.83 2.03,28.07 2.79,28.11 | 2.79,28.11 R4.2 | 2.79,28.11 2.79,26.3 SW1.2 SW1.4 2.89,21.37 4.19,20.32 4.45,20.07 4.45,19.43 5.97,19.43 6.35,19.05 6.35,17.65 | 6.35,17.65 6.35,17.14 6.04,16.83 IC2.3 5.44,16.74 6.46,15.64 v6.6,15.24 | 6.35,17.65 7.47,17.65 IC2.5
  Bottom 0.254: v56.39,14.1 56.01,14.1 55.88,13.97 | v6.6,15.24 8.38,13.84 9.02,12.57
  Bottom 0.406: IC1.1 40.74,13.72 42.8,13.72 42.93,13.84 | 41.28,10.29 41.28,10.28 | U3.3 40.33,22.54 | 41.91,21.59 42.34,21.59 L2.P$1
  Bottom 0.61: 57.15,16.89 C6.1 57.27,18.54 57.53,18.8 57.53,19.59 U1.3 | C1.2
  Bottom 0.813: 41.27,1.14 9.91,1.14 9.91,11.56 PF1.2 9.02,12.57 | 41.27,1.14 53.59,1.14 55.88,3.81 55.88,13.97 57.15,15.24 57.15,16.89 | C1.2 41.28,10.28 | 42.93,17.53 42.93,13.84 | 42.8,13.72 43.56,12.95 43.56,10.67 43.18,10.29 41.28,10.29 | 42.93,17.53 42.42,18.03 L2.P$1 | C11.1 43.04,17.41 42.93,17.53 | 40.33,22.54 41.91,21.59 | C1.2 41.27,1.14
VBAT_MEAS  (via drill 0.6)
  Top 0.254: v53.34,21.59 53.34,20.57 54.99,18.92 54.99,12.51 R6.1 R7.2
  Bottom 0.254: IC3.A6 48.51,20.57 49.53,21.59 v53.34,21.59
VDD1  (via drill 0.6)
  Top 0.406: LED1.A 58.2,32.8 v58.17,32.77
  Bottom 0.406: CN3.VBUS 56.64,30.81 | 56.64,30.81 56.82,30.81 57.4,30.23 57.4,27.81 57.02,27.3 57.02,26.54 57.66,25.91 57.66,22.44 U1.4 55.4,22.25 C5.1 | v58.17,32.77 57.91,32.77 56.9,31.75 56.9,31.06 56.64,30.81

### Text on the board
tNames: EC | LED | UART | SQUID CarrierBoard V7
bNames: 3V | VORP | +3V3 | PH | GND | T | 5V | GND | SCL | SDA | GND | BUZ | LED | GND | +5V | CHRG